# Altium schematic sheet QCW_GDT_PCB.SchDoc
size A3
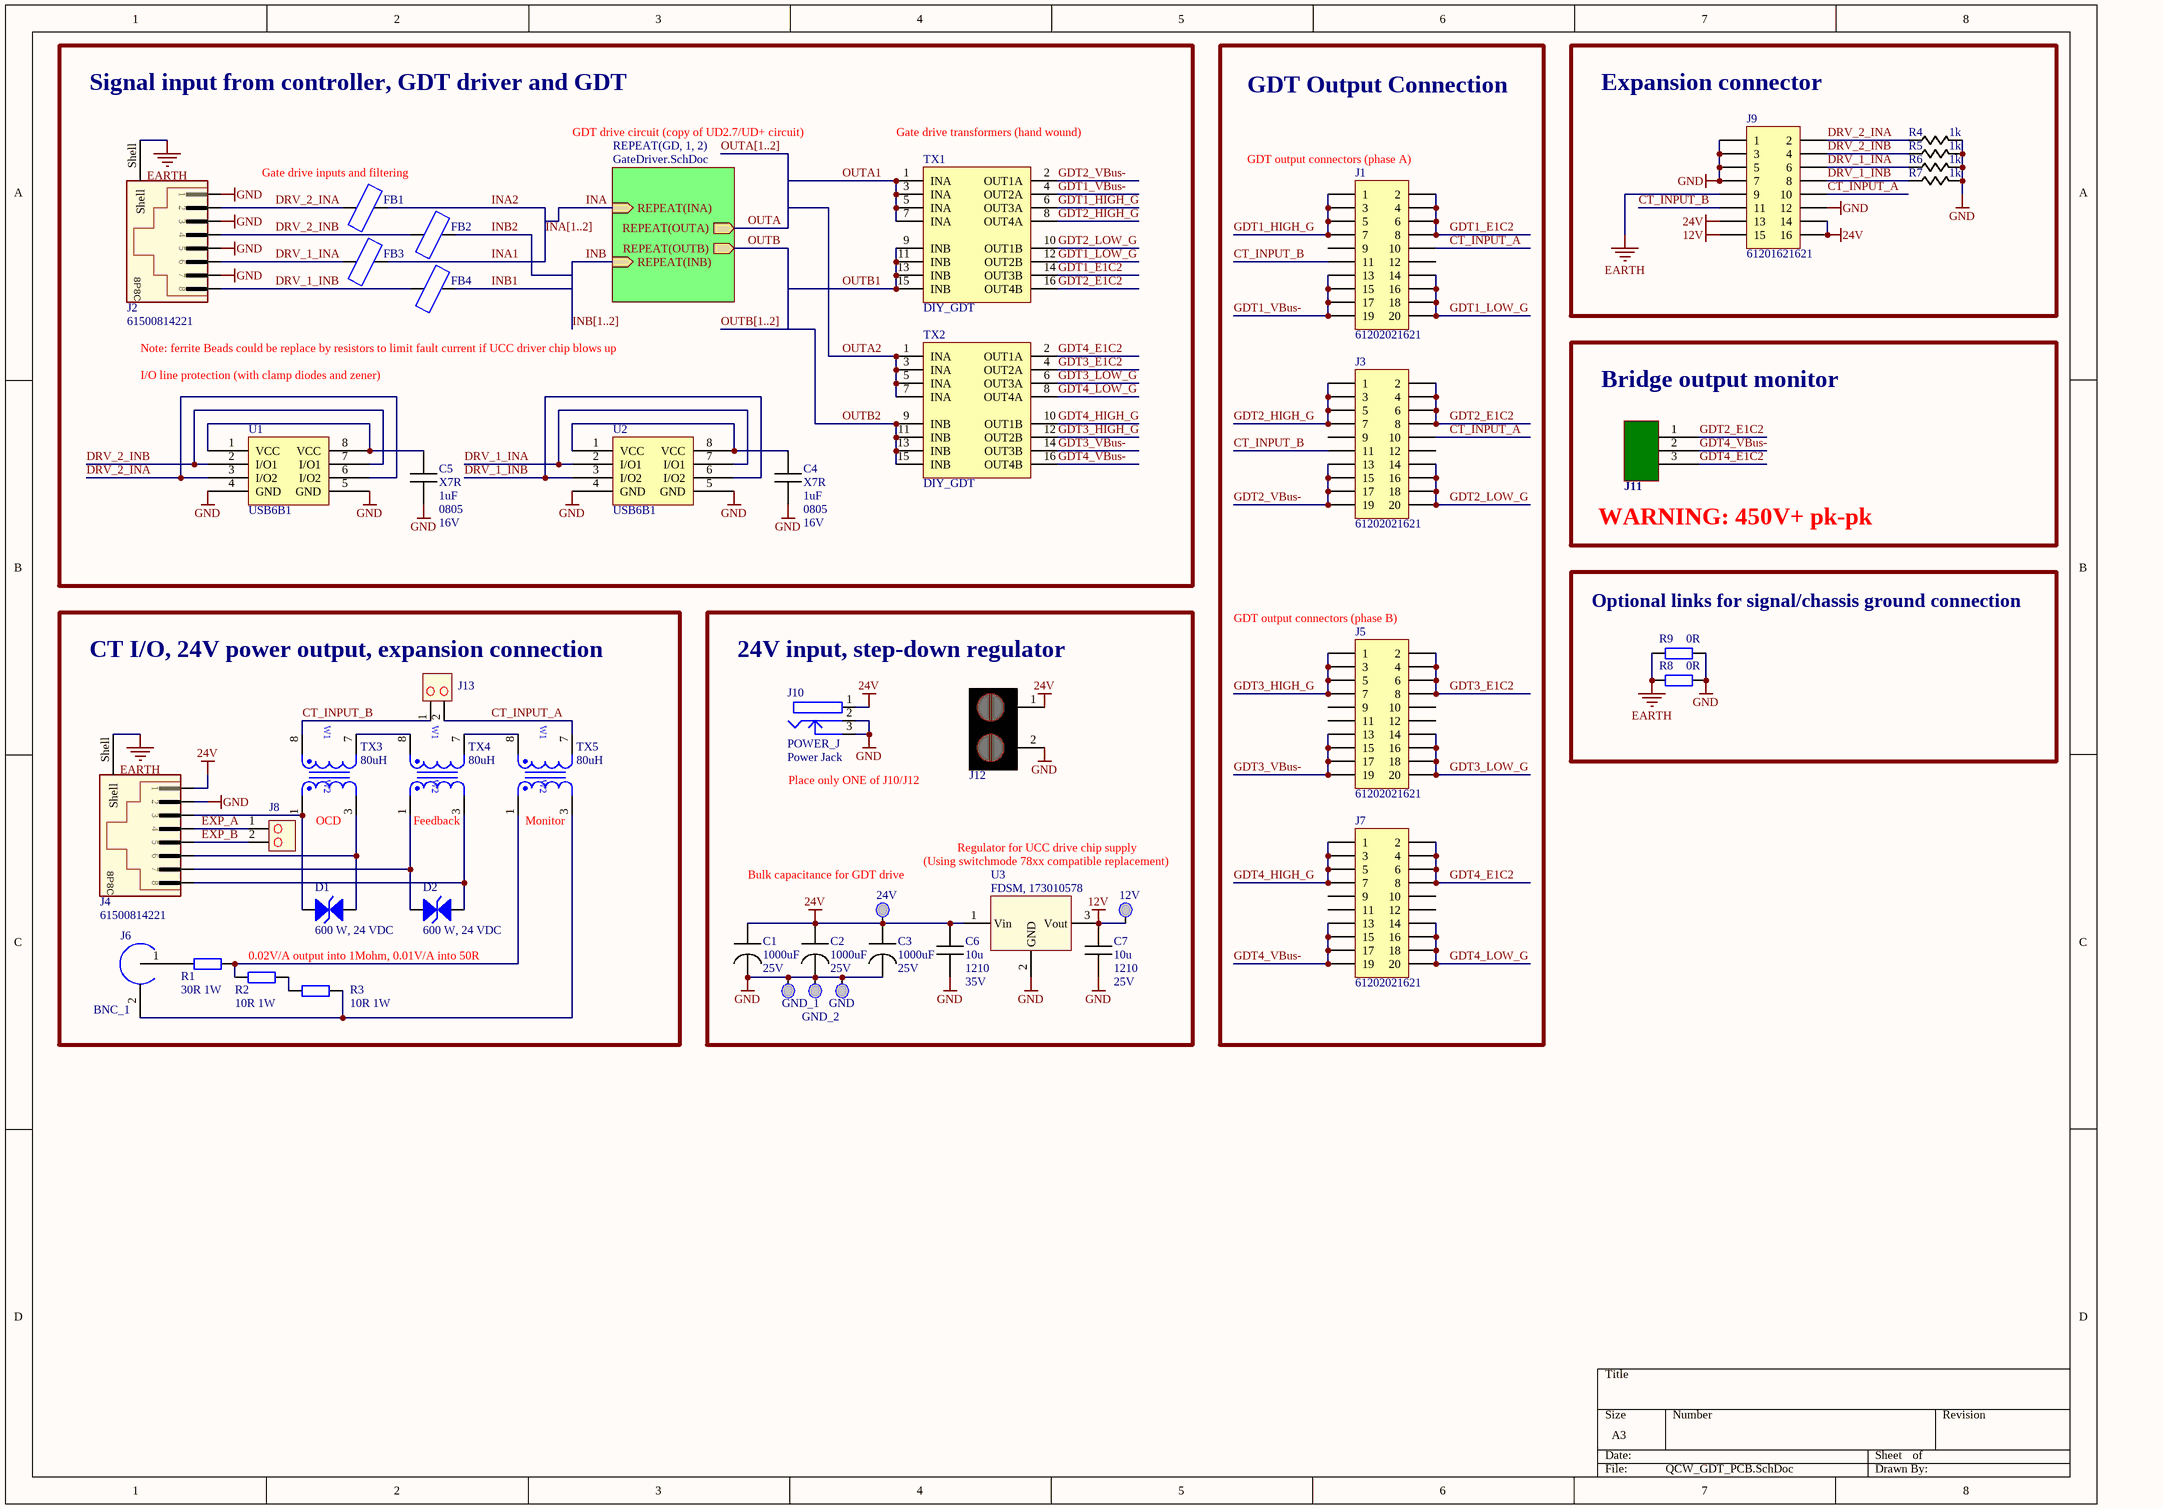
[diagram p0: QCW_GDT_PCB.SchDoc]

## Parts
12V  Testpoint  [Keystone5004]  (value not drawn)  (no BOM)
24V  Testpoint  [Keystone5000]  (value not drawn)  (no BOM)
C1  Capacitance: 1000uF  Voltage: 25V  [12.5mm lytic]  (hidden comment: EEU-FM1E102)
C2  Capacitance: 1000uF  Voltage: 25V  [12.5mm lytic]  (hidden comment: EEU-FM1E102)
C3  Capacitance: 1000uF  Voltage: 25V  [12.5mm lytic]  (hidden comment: EEU-FM1E102)
C4  Material: X7R  Capacitance: 1uF  Package: 0805  Voltage: 16V  [0805C]  (hidden comment: CC0805KKX7R7BB105)
C5  Material: X7R  Capacitance: 1uF  Package: 0805  Voltage: 16V  [0805C]  (hidden comment: CC0805KKX7R7BB105)
C6  Capacitance: 10u  package: 1210  voltage: 35V  [1210C]  (hidden comment: 885012209028)
C7  Capacitance: 10u  package: 1210  voltage: 25V  [1210C]  (hidden comment: 885012209028)
D1  600 W, 24 VDC  [DO-214AA_Bidirectional]
D2  600 W, 24 VDC  [DO-214AA_Bidirectional]
FB1  FerriteBead  [0805FB]  (value not drawn)
FB2  FerriteBead  [0805FB]  (value not drawn)
FB3  FerriteBead  [0805FB]  (value not drawn)
FB4  FerriteBead  [0805FB]  (value not drawn)
GND  Testpoint  [Keystone5001]  (value not drawn)  (no BOM)
GND_1  Testpoint  [Keystone5001]  (value not drawn)  (no BOM)
GND_2  Testpoint  [Keystone5001]  (value not drawn)  (no BOM)
J1  61202021621  [61202021621]
J2  61500814221  [61500814221]
J3  61202021621  [61202021621]
J4  61500814221  [61500814221]
J5  61202021621  [61202021621]
J6  BNC_1  [BNC_PLASTIC_ELBOW_SOCKET_WITH_MOUNTING_POSTS]
J7  61202021621  [61202021621]
J8  22-23-2021  [22-23-2021]  (value not drawn)
J9  61201621621  [61201621621]
J10  POWER_J  value Power Jack  [POWER_J_SLOT]
J11  Header_3_right_angle_th_3.81mm  [691322310003]  (value not drawn)
J12  Header_2_5.08mm_Screw_Black  [1776119-2]  (value not drawn)
J13  22-23-2021  [22-23-2021]  (value not drawn)
R1  30R 1W  [RES_2512]
R2  10R 1W  [RES_2512]
R3  10R 1W  [RES_2512]
R4  Resistance: 1k  [0805R]  (hidden comment: RC0805FR-071KL)
R5  Resistance: 1k  [0805R]  (hidden comment: RC0805FR-071KL)
R6  Resistance: 1k  [0805R]  (hidden comment: RC0805FR-071KL)
R7  Resistance: 1k  [0805R]  (hidden comment: RC0805FR-071KL)
R8  0R  [1206R]
R9  0R  [1206R]
TX1  DIY_GDT  [GDT_DIY]
TX2  DIY_GDT  [GDT_DIY]
TX3  80uH  [WE-CST_EE5]
TX4  80uH  [WE-CST_EE5]
TX5  80uH  [WE-CST_EE5]
U1  USB6B1  [SOIC-8]
U2  USB6B1  [SOIC-8]
U3  FDSM, 173010578  [WE-FDSM_173010x78]

## Blocks framed on the sheet
Signal input from controller, GDT driver and GDT: C4 C5 FB1-FB4 J2 TX1 TX2 U1 U2
GDT Output Connection: J1 J3 J5 J7
Expansion connector: J9 R4-R7
Optional links for signal/chassis ground connection: R8 R9
CT I/O, 24V power output, expansion connection: D1 D2 J4 J6 J8 J13 R1-R3 TX3-TX5
24V input, step-down regulator: 12V 24V C1-C3 C6 C7 GND GND_1 GND_2 J10 J12 U3

## Sub-sheets
REPEAT(GD, 1, 2) = GateDriver.SchDoc: REPEAT(OUTB) (out), REPEAT(OUTA) (out), REPEAT(INB) (in), REPEAT(INA) (in)

## Nets
12V: 12V.1 C7.1 J9.15 U3.3(Vout)
24V: 24V.1 C1.1 C2.1 C3.1 C6.1 J4.1 J9.13 J9.14 J9.16 J10.1 J12.1 U3.1(Vin)
EARTH: J2.Shell J4.Shell J9.9 R8.2 R9.2
GND: C1.2 C2.2 C3.2 C4.1 C5.1 C6.2 C7.2 GND.1 GND_1.1 GND_2.1 J2.1 J2.3 J2.5 J2.7 J4.2 J9.1 J9.3 J9.5 J9.7 J9.12 J10.2 J10.3 J12.2 R4.1 R5.1 R6.1 R7.1 R8.1 R9.1 U1.4(GND) U1.5(GND) U2.4(GND) U2.5(GND) U3.2(GND)
CT_INPUT_A: J1.10 J3.10 J9.10 J13.2 TX5.7
CT_INPUT_B: J1.11 J3.11 J9.11 J13.1 TX3.8
DRV_1_INA: FB3.1 J2.6 J9.6 R6.2 U2.2(I/O1) U2.7(I/O1)
DRV_1_INB: FB4.1 J2.8 J9.8 R7.2 U2.3(I/O2) U2.6(I/O2)
DRV_2_INA: FB1.1 J2.2 J9.2 R4.2 U1.3(I/O2) U1.6(I/O2)
DRV_2_INB: FB2.1 J2.4 J9.4 R5.2 U1.2(I/O1) U1.7(I/O1)
EXP_A: J4.4 J8.1
EXP_B: J4.5 J8.2
GDT1_E1C2: J1.2 J1.4 J1.6 J1.8 TX1.14(OUT3B)
GDT1_HIGH_G: J1.1 J1.3 J1.5 J1.7 TX1.6(OUT3A)
GDT1_LOW_G: J1.14 J1.16 J1.18 J1.20 TX1.12(OUT2B)
GDT1_VBus-: J1.13 J1.15 J1.17 J1.19 TX1.4(OUT2A)
GDT2_E1C2: J3.2 J3.4 J3.6 J3.8 J11.1 TX1.16(OUT4B)
GDT2_HIGH_G: J3.1 J3.3 J3.5 J3.7 TX1.8(OUT4A)
GDT2_LOW_G: J3.14 J3.16 J3.18 J3.20 TX1.10(OUT1B)
GDT2_VBus-: J3.13 J3.15 J3.17 J3.19 TX1.2(OUT1A)
GDT3_E1C2: J5.2 J5.4 J5.6 J5.8 TX2.4(OUT2A)
GDT3_HIGH_G: J5.1 J5.3 J5.5 J5.7 TX2.12(OUT2B)
GDT3_LOW_G: J5.14 J5.16 J5.18 J5.20 TX2.6(OUT3A)
GDT3_VBus-: J5.13 J5.15 J5.17 J5.19 TX2.14(OUT3B)
GDT4_E1C2: J7.2 J7.4 J7.6 J7.8 J11.3 TX2.2(OUT1A)
GDT4_HIGH_G: J7.1 J7.3 J7.5 J7.7 TX2.10(OUT1B)
GDT4_LOW_G: J7.14 J7.16 J7.18 J7.20 TX2.8(OUT4A)
GDT4_VBus-: J7.13 J7.15 J7.17 J7.19 J11.2 TX2.16(OUT4B)
INA: sheet REPEAT(GD, 1, 2)/REPEAT(INA)
INA1: FB3.2
INA2: FB1.2
INB: sheet REPEAT(GD, 1, 2)/REPEAT(INB)
INB1: FB4.2
INB2: FB2.2
OUTA: sheet REPEAT(GD, 1, 2)/REPEAT(OUTA)
OUTA1: TX1.1(INA) TX1.3(INA) TX1.5(INA) TX1.7(INA)
OUTA2: TX2.1(INA) TX2.3(INA) TX2.5(INA) TX2.7(INA)
OUTB: sheet REPEAT(GD, 1, 2)/REPEAT(OUTB)
OUTB1: TX1.9(INB) TX1.11(INB) TX1.13(INB) TX1.15(INB)
OUTB2: TX2.9(INB) TX2.11(INB) TX2.13(INB) TX2.15(INB)
NetC4_2: C4.2 U2.1(VCC) U2.8(VCC)
NetC5_2: C5.2 U1.1(VCC) U1.8(VCC)
NetD1_1: D1.1 J4.3 TX3.1
NetD1_2: D1.2 J4.6 TX3.3
NetD2_1: D2.1 J4.7 TX4.1
NetD2_2: D2.2 J4.8 TX4.3
NetJ6_1: J6.1(Centre) R1.2
NetJ6_2: J6.2(Shield) R3.1 TX5.3
NetR1_1: R1.1 R2.2 TX5.1
NetR2_1: R2.1 R3.2
NetTX3_7: TX3.7 TX4.8
NetTX4_7: TX4.7 TX5.8

Not connected (* = marked no-connect by the designer): J1 9 12; J3 9 12; J5 9 10 11 12; J7 9 10 11 12

## Buses and harness runs
bus INA[1..2]
bus INB[1..2]
bus OUTA[1..2]
bus OUTB[1..2]

## Notes on the sheet
- (near FB1) Gate drive inputs and filtering
- GDT drive circuit (copy of UD2.7/UD+ circuit)
- (near TX1) Gate drive transformers (hand wound)
- (near J1) GDT output connectors (phase A)
- I/O line protection (with clamp diodes and zener)
- Note: ferrite Beads could be replace by resistors to limit fault current if UCC driver chip blows up
- (near J11) Bridge output monitor
- (near J11) WARNING: 450V+ pk-pk
- (near J5) GDT output connectors (phase B)
- (near J10) Place only ONE of J10/J12
- (near TX3) OCD
- (near TX4) Feedback
- (near TX5) Monitor
- Regulator for UCC drive chip supply
- (near 24V) Bulk capacitance for GDT drive
- (Using switchmode 78xx compatible replacement)
- (near R2) 0.02V/A output into 1Mohm, 0.01V/A into 50R
- (in symbol WE-CST, 749251020) W1; W2

## Library data of the parts
C1-C3 = Electrolytic Capacitor: CAP ALUM 1000UF 20% 25V RADIAL; Mouser Part: 667-EEU-FM1E102; Digikey Part: P12379-ND
C4 C5 = Capacitor: CAP CER 1UF 16V X7R 0805; Tolerance: 10%; Mouser Part: 603-CC805KKX7R7BB105; Digikey Part: 311-1365-1-ND
C6 C7 = Capacitor: tolerance: *; type: *; material: *
D1 D2 = WE-TVSP DO-214AA, 824521241: WE-TVSP Power TVS Diode, bidirectional, 600 W, 24 VDC; Manufacturer: Wurth Elektronik; partNo: 824521241; ComponentLink1Description: Manufacturer; ComponentLink1URL: http://www.we-online.de; Created by: Baojun Chen; Created Date: Nov.2015; ComponentLink2Description: Datasheet; ComponentLink2URL: http://katalog.we-online.de/pbs/datasheet/824521241.pdf
FB1-FB4 = FerriteBead: Ferrite Bead
J1 J3 J5 J7 = 61202021621: WR-BHD 2.54mm Male Box Header; Manufacturer: Wurth Elektronik; ComponentLink1 Description: Manufacturer; ComponentLink2 Description: Datasheet; NoPins: 20; Created Date: March 2016; partNo: 61202021621; ComponentLink1URL: http://www.we-online.com; ComponentLink2URL: http://katalog.we-online.de/em/datasheet/6120xx21621.pdf; Created by: Baojun Chen
J2 J4 = 61500814221: WR-MJ Modular Jack Horizontal Shielded 8P8C Tab Down; PublishedDate: July 2016; Publisher: Wurth Elektronik; ComponentLink1Description: Manufacturer; ComponentLink1URL: http://www.we-online.de; ComponentLink2Description: Datasheet; ComponentLink2URL: http://katalog.we-online.de/em/datasheet/61500814221.pdf; PartNumber: 61500814221; PinNumber: 8P8C
J6 = BNC_1: BNC Connector; Value: =Value
J8 J13 = 22-23-2021: Pin Header, 2 Position, Locking, .1 Centers
J9 = 61201621621: WR-BHD 2.54mm Male Box Header; Manufacturer: Wurth Elektronik; ComponentLink1 Description: Manufacturer; ComponentLink2 Description: Datasheet; NoPins: 16; Created Date: March 2016; partNo: 61201621621; ComponentLink1URL: http://www.we-online.com; ComponentLink2URL: http://katalog.we-online.de/em/datasheet/6120xx21621.pdf; Created by: Baojun Chen
J10 = POWER_J: Low Voltage Power Supply Connector; Part_Number: OVC-CON-10108; Published: 17-Dec-2003; DatasheetDocument: 09-May-2002; Publisher: Altium Limited; ComponentLink1Description: Manufacturer Link; ComponentLink1URL: http://domino.kycon.com/internet/Products.html
J11 = Header_3_right_angle_th_3.81mm: 3-way header; Component_Replaceability: B; Component_Description: 3 Way right angle through hole 3.81mm header (green); Datasheet_Link: http://katalog.we-online.de/em/datasheet/6913223100xx.pdf; Digikey_Code: 732-2089-ND; Farnell_Code: 1642013; Category: Connectors
J12 = Header_2_5.08mm_Screw_Black: 2-way PCB connector; Value: =Value
R1-R3 R8 R9 = Resistor: Power: *; Tolerance: *
R4-R7 = Resistor: RES SMD 1K OHM 1% 1/8W 0805; Power: 0.125W; Package: 0805; Tolerance: 1%; Mouser Part: 603-RC0805FR-071KL; Digikey Part: 311-1.00KCRCT-ND
TX1 TX2 = GDT_DIY: DIY Gate Drive TX on 36x22x14 toroid
TX3-TX5 = WE-CST, 749251020: WE-CST Current Sense Transformer, EE5, 80uH; TurnsRatio: 1:20; RatedVoltage: 500V(AC); PublishedDate: Aug 2016; Publisher: Wurth Elektronik; ComponentLink1Description: Manufacturer; ComponentLink1URL: http://www.we-online.de; ComponentLink2Description: Datasheet; ComponentLink2URL: http://katalog.we-online.de/pbs/datasheet/749251020.pdf; PartNumber: 749251020; Value: 80uH; Size: EE5
U1 U2 = USB6B1: USB Data Line Protection; Letechnic p/n: 6400026; Status: Fitted
U3 = FDSM, 173010578: MagI³C-FDSM Fixed Step Down Regulator Module; InputVoltage: 8-28V; OutputCurrent: 1A; PublishedDate: Aug 2016; Publisher: Wurth Elektronik; ComponentLink1Description: Manufacturer; ComponentLink1URL: http://www.we-online.de; ComponentLink2Description: Datasheet; ComponentLink2URL: http://katalog.we-online.de/pm/datasheet/173010578.pdf; PartNumber: 173010578; Size: SIP-3
12V 24V GND GND_1 GND_2 = Testpoint: Digikey Part: *; Mouser Part: *